# EAGLE schematic esc_board (EAGLE 9.2.2)
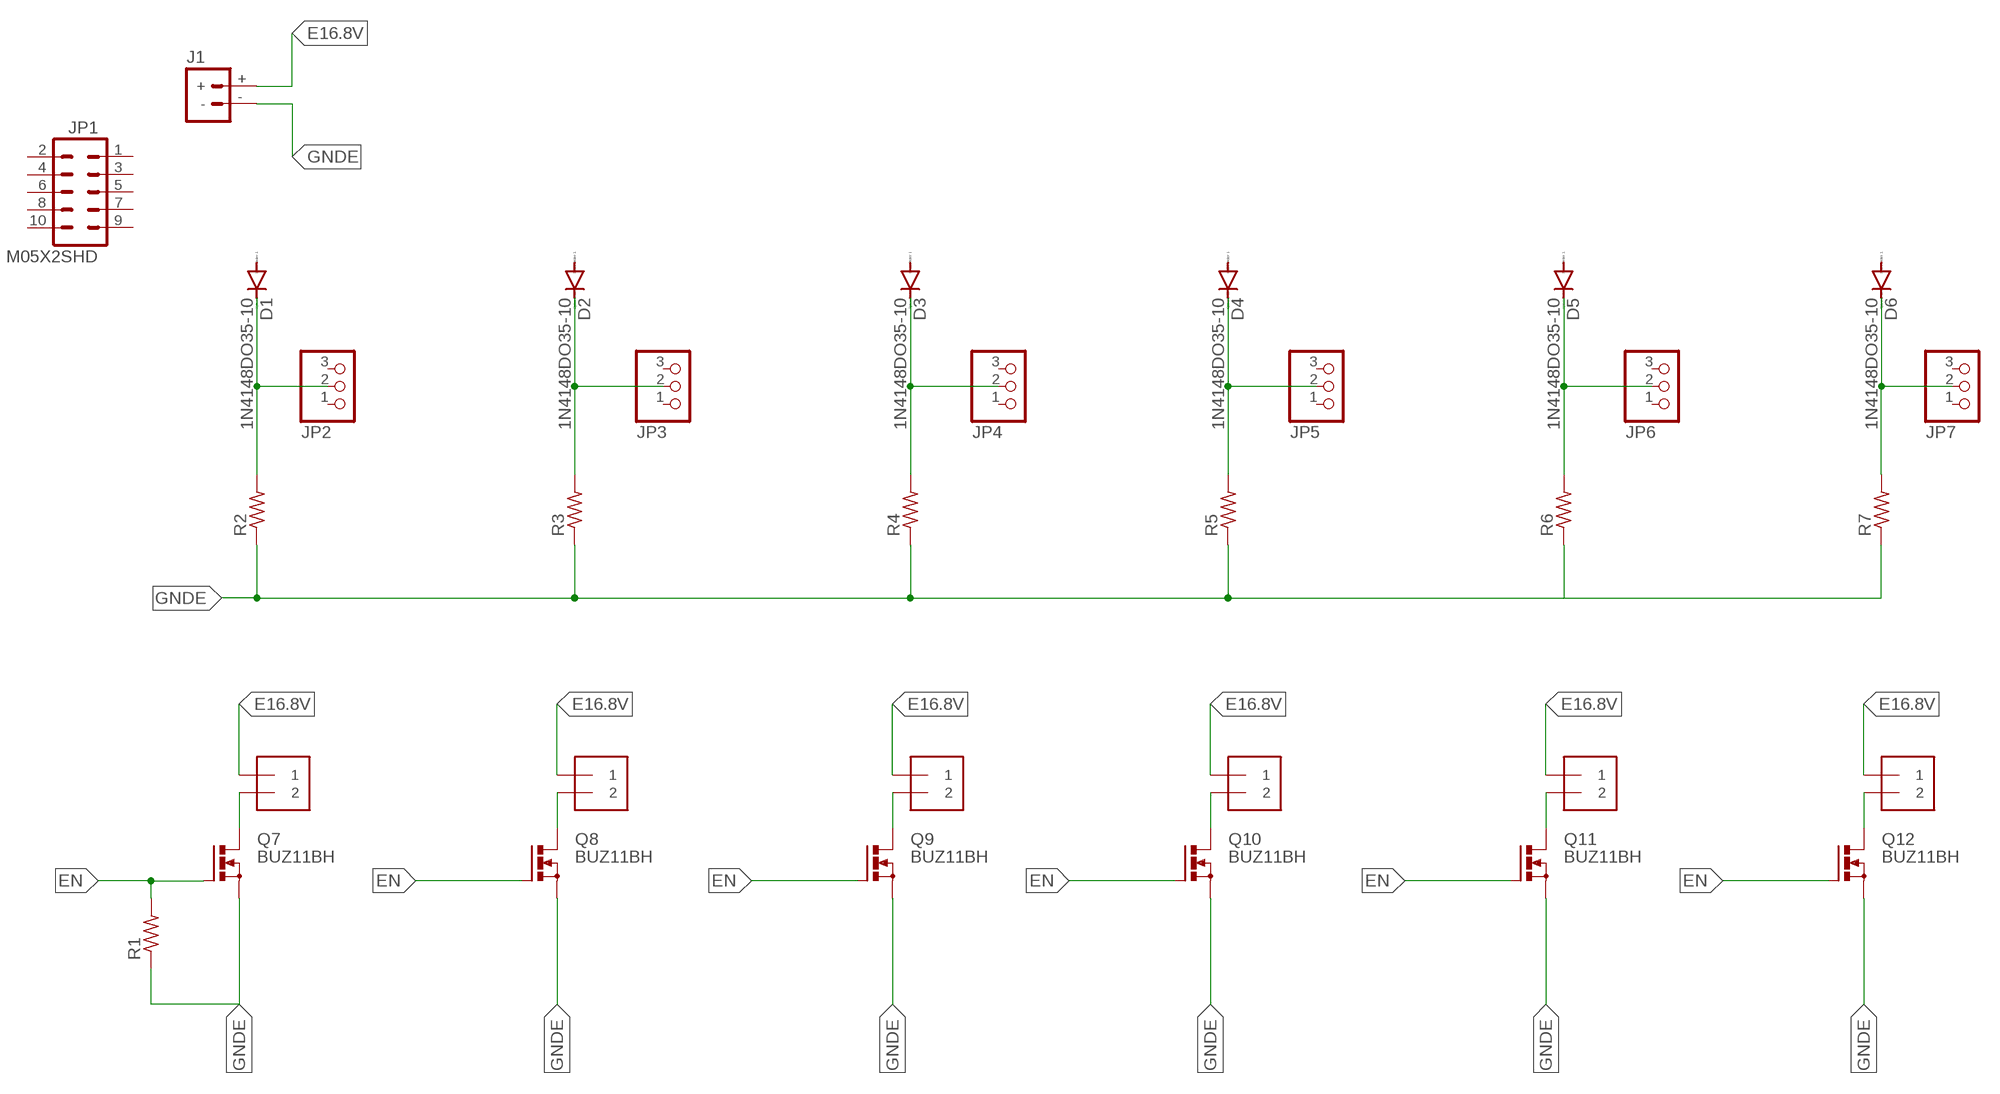
[diagram p0: schematic, sheet 1]

## Parts
D1  1N4148DO35-10  [DO35-10]
D2  1N4148DO35-10  [DO35-10]
D3  1N4148DO35-10  [DO35-10]
D4  1N4148DO35-10  [DO35-10]
D5  1N4148DO35-10  [DO35-10]
D6  1N4148DO35-10  [DO35-10]
J1  BATTERY_CONN_DEANS  [DEANS]
J7  1X2-3.5MM  [1X2-3.5MM]
J8  1X2-3.5MM  [1X2-3.5MM]
J9  1X2-3.5MM  [1X2-3.5MM]
J10  1X2-3.5MM  [1X2-3.5MM]
J11  1X2-3.5MM  [1X2-3.5MM]
J12  1X2-3.5MM  [1X2-3.5MM]
JP1  M05X2SHD  [2X5-SHROUDED]
JP2  PINHD-1X3  [1X03]
JP3  PINHD-1X3  [1X03]
JP4  PINHD-1X3  [1X03]
JP5  PINHD-1X3  [1X03]
JP6  PINHD-1X3  [1X03]
JP7  PINHD-1X3  [1X03]
Q7  BUZ11BH  [TO220BH]
Q8  BUZ11BH  [TO220BH]
Q9  BUZ11BH  [TO220BH]
Q10  BUZ11BH  [TO220BH]
Q11  BUZ11BH  [TO220BH]
Q12  BUZ11BH  [TO220BH]
R1  R-US_0204/7  [0204/7]
R2  R-US_0204/7  [0204/7]
R3  R-US_0204/7  [0204/7]
R4  R-US_0204/7  [0204/7]
R5  R-US_0204/7  [0204/7]
R6  R-US_0204/7  [0204/7]
R7  R-US_0204/7  [0204/7]

## Nets
E16.8V: J1.+ J7.1 J8.1 J9.1 J10.1 J11.1 J12.1
EN: Q7.G Q8.G Q9.G Q10.G Q11.G Q12.G R1.2
GNDE: J1.- Q7.S Q8.S Q9.S Q10.S Q11.S Q12.S R1.1 R2.1 R3.1 R4.1 R5.1 R6.1 R7.1
N$2: J7.2 Q7.D
N$3: D1.C JP2.2 R2.2
N$5: J8.2 Q8.D
N$6: D2.C JP3.2 R3.2
N$8: J9.2 Q9.D
N$9: D3.C JP4.2 R4.2
N$11: J10.2 Q10.D
N$12: D4.C JP5.2 R5.2
N$14: J11.2 Q11.D
N$15: D5.C JP6.2 R6.2
N$16: D6.C JP7.2 R7.2
N$17: J12.2 Q12.D
Unconnected: D1.A D2.A D3.A D4.A D5.A D6.A JP1.1 JP1.2 JP1.3 JP1.4 JP1.5 JP1.6 JP1.7 JP1.8 JP1.9 JP1.10 JP2.1 JP2.3 JP3.1 JP3.3 JP4.1 JP4.3 JP5.1 JP5.3 JP6.1 JP6.3 JP7.1 JP7.3

## Library data of the parts
D1-D6 = diode:1N4148: DIODE high speed (Philips)
J1 = SparkFun-Connectors:BATTERY_CONN: Battery Connectors Various footprints for battery connections SparkFun Products: Deans Connector -M/F Pair <https://www.sparkfun.com/products/11864>; SF_ID: PRT-11864
J7-J12 = adafruit:1X2: 3.5mm Terminal block http://www.ladyada.net/library/pcb/eaglelibrary.html
JP1 = SparkFun-Connectors:M05X2: Header 5x2 Standard 10-pin dual row 0.1" header. Commonly used with AVR-ISP. Use with Spark Fun Electronics SKU: PRT-00778
JP2-JP7 = adafruit:PINHD-1X3: PIN HEADER
Q7-Q12 = transistor-power:BUZ11: N-CHANNEL MOS FET
R1-R7 = rcl:R-US_: RESISTOR, American symbol; SPICEPREFIX: R